# Altium schematic sheet 0073_HSIO MUXING -4.SchDoc
size 848 x 558 mm
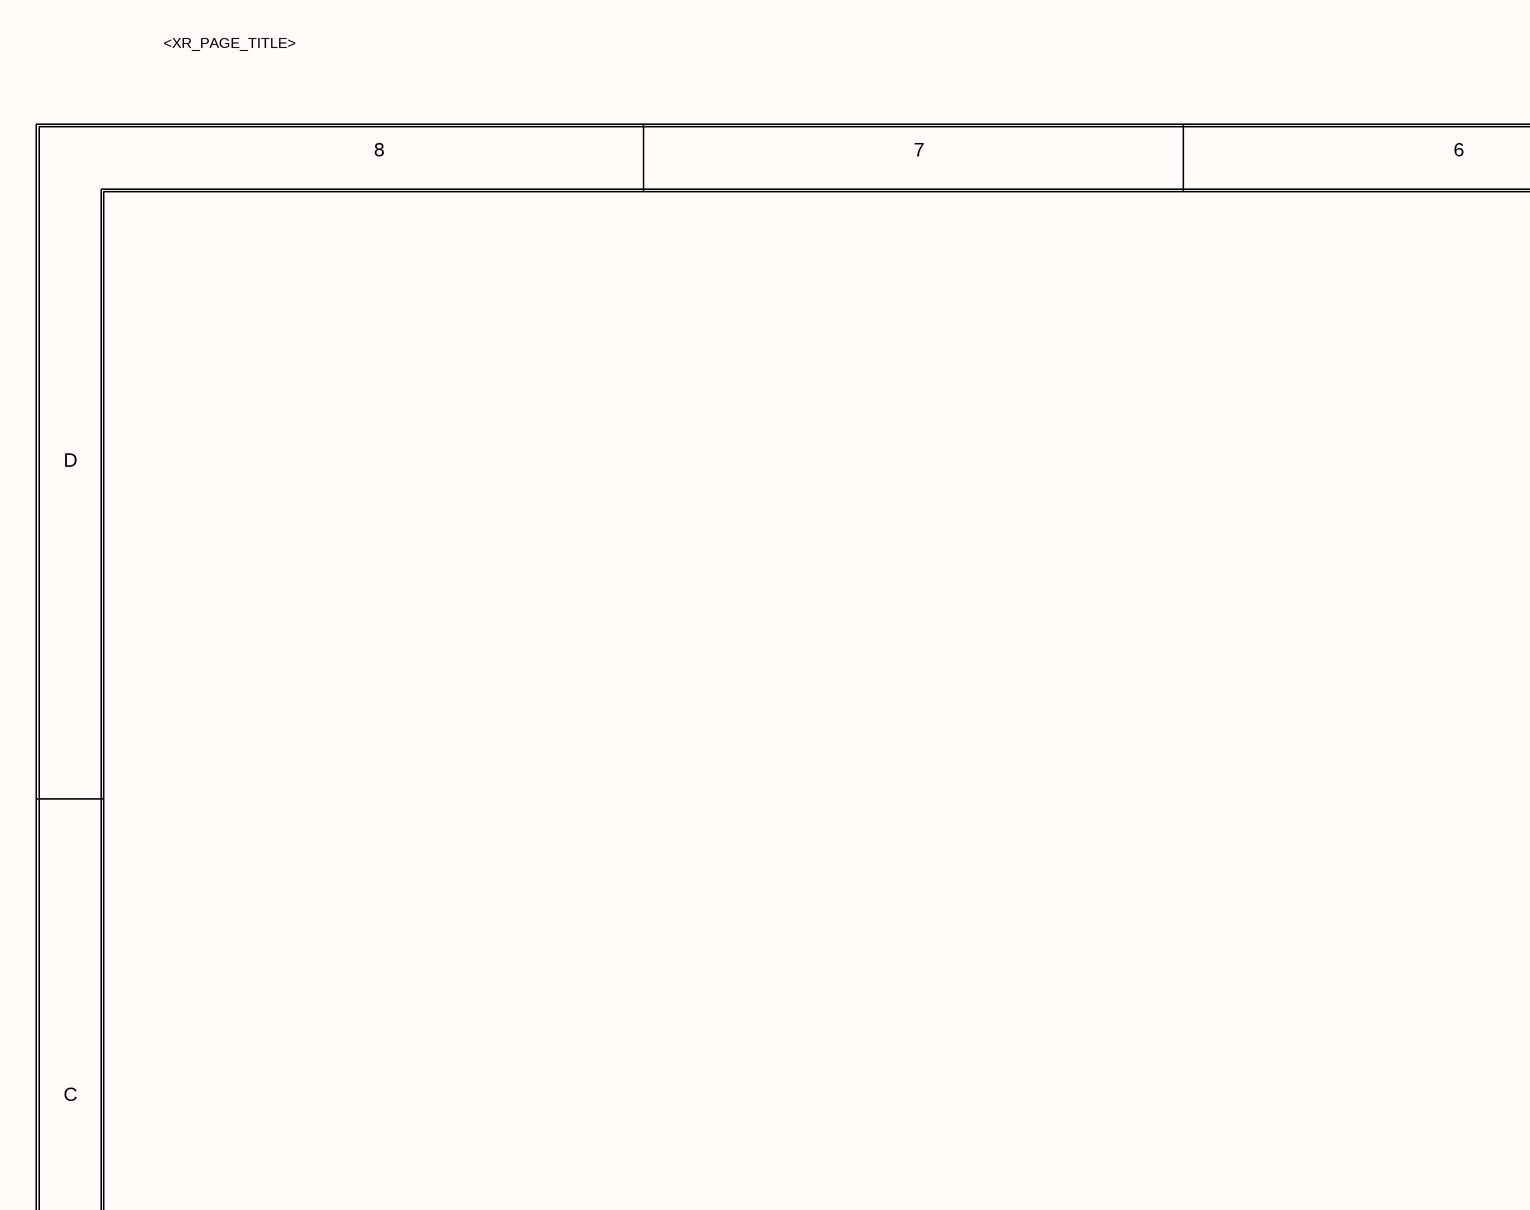
[diagram p0: 0073_HSIO MUXING -4.SchDoc, top left]
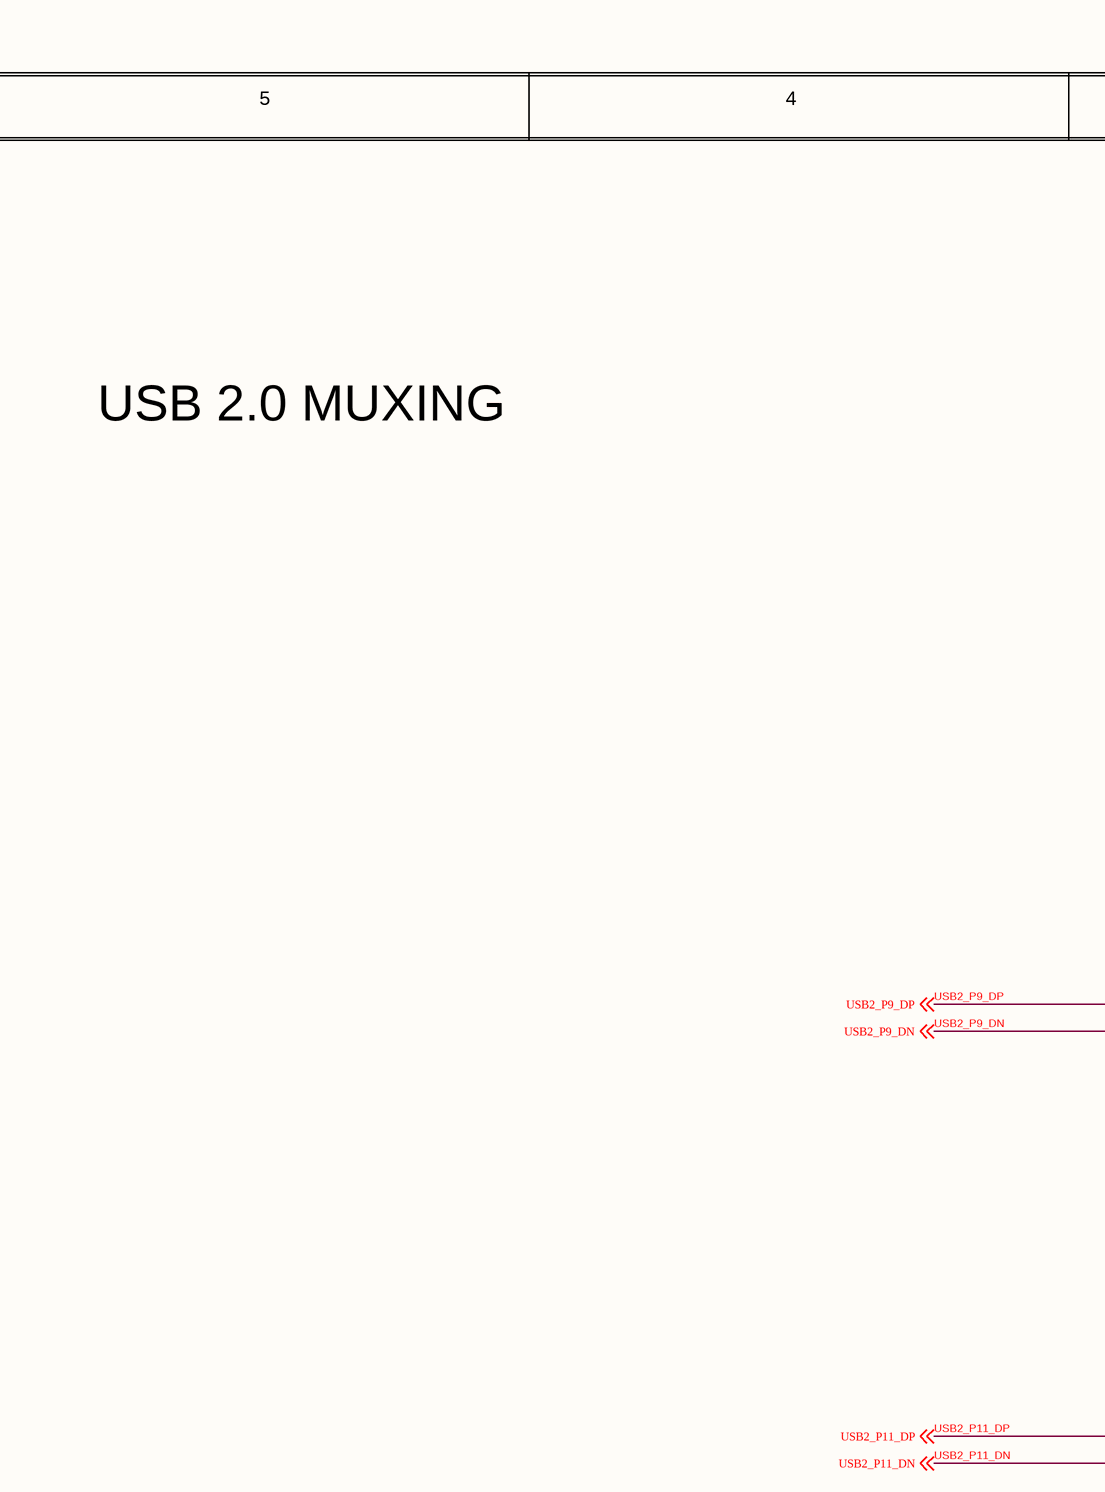
[diagram p1: 0073_HSIO MUXING -4.SchDoc, top middle]
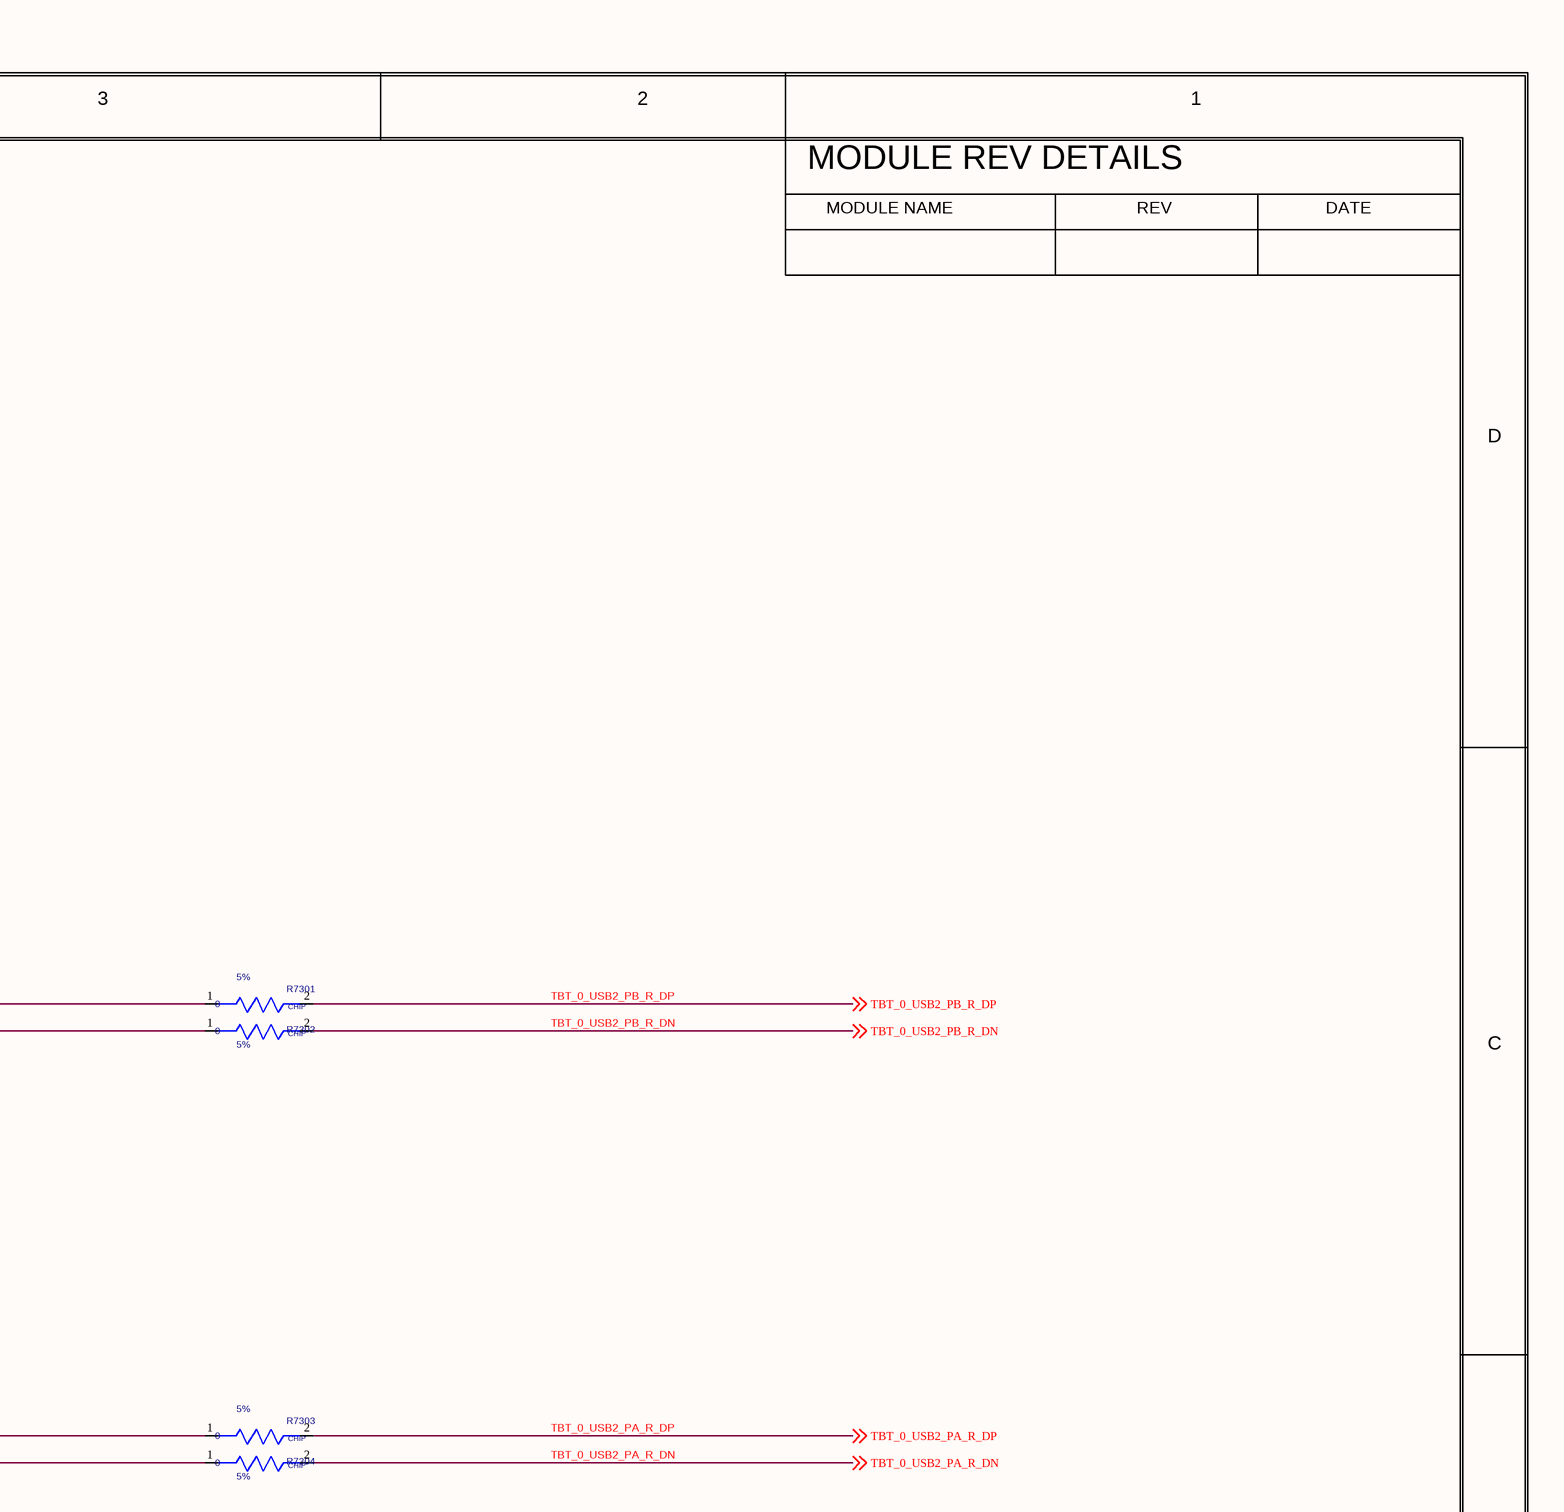
[diagram p2: 0073_HSIO MUXING -4.SchDoc, top right]
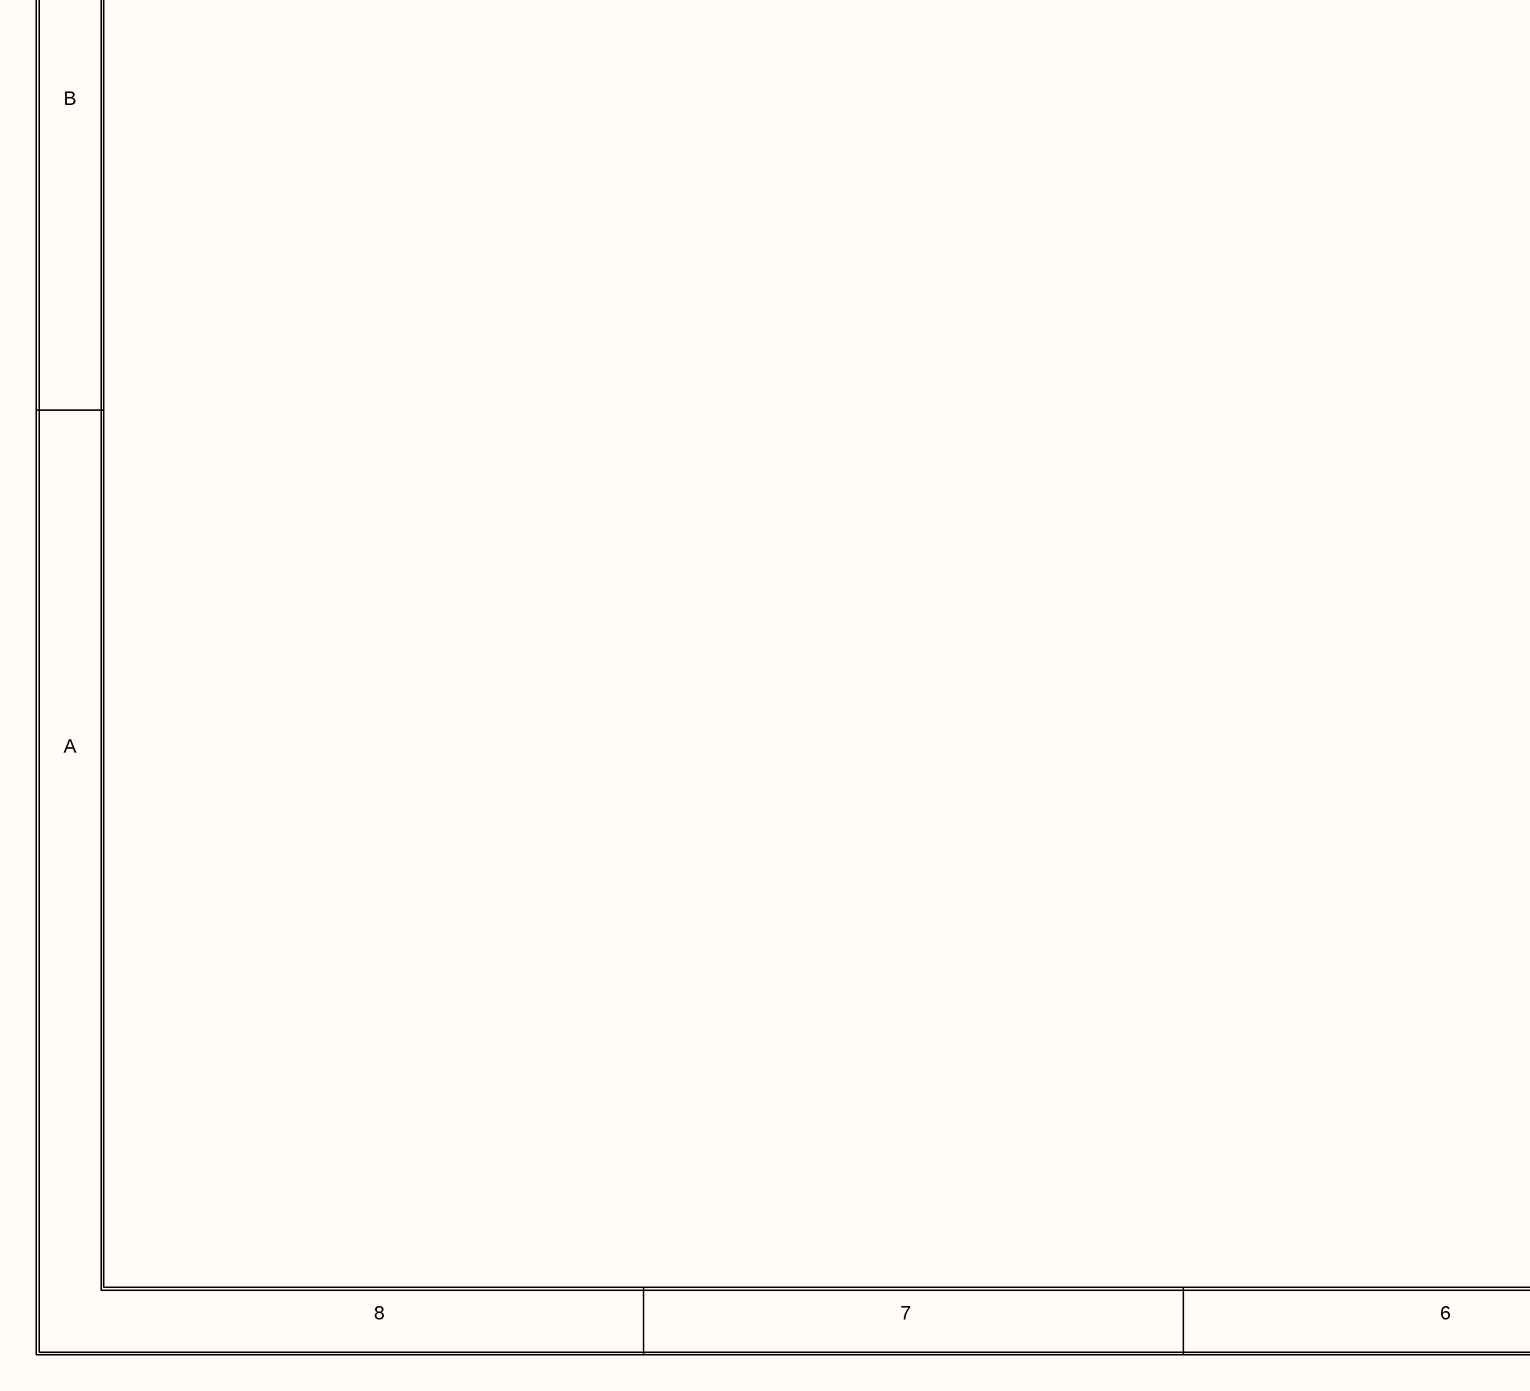
[diagram p3: 0073_HSIO MUXING -4.SchDoc, bottom left]
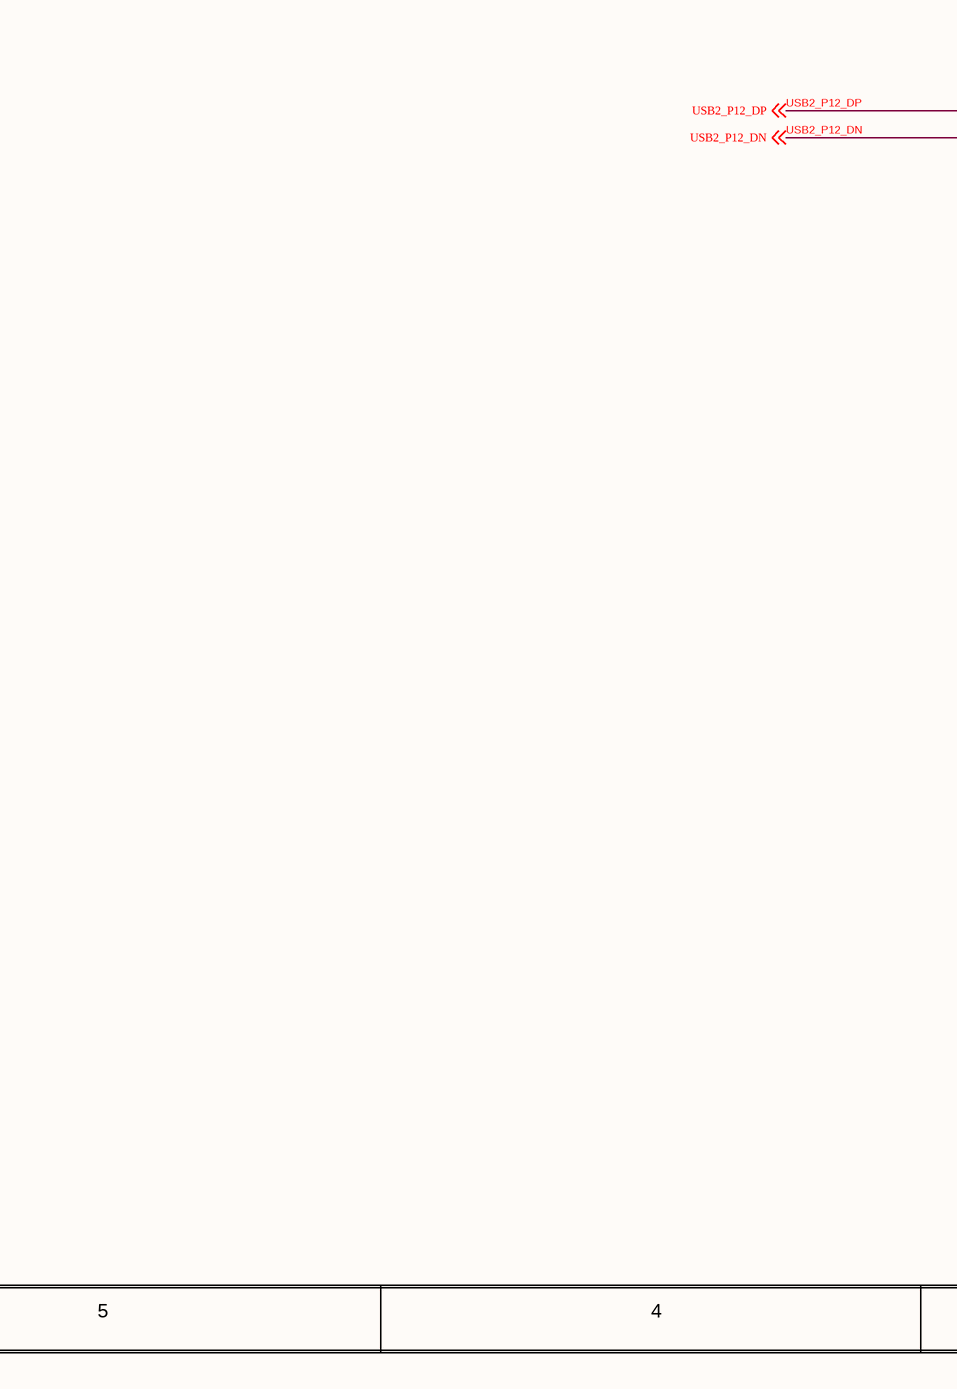
[diagram p4: 0073_HSIO MUXING -4.SchDoc, bottom middle]
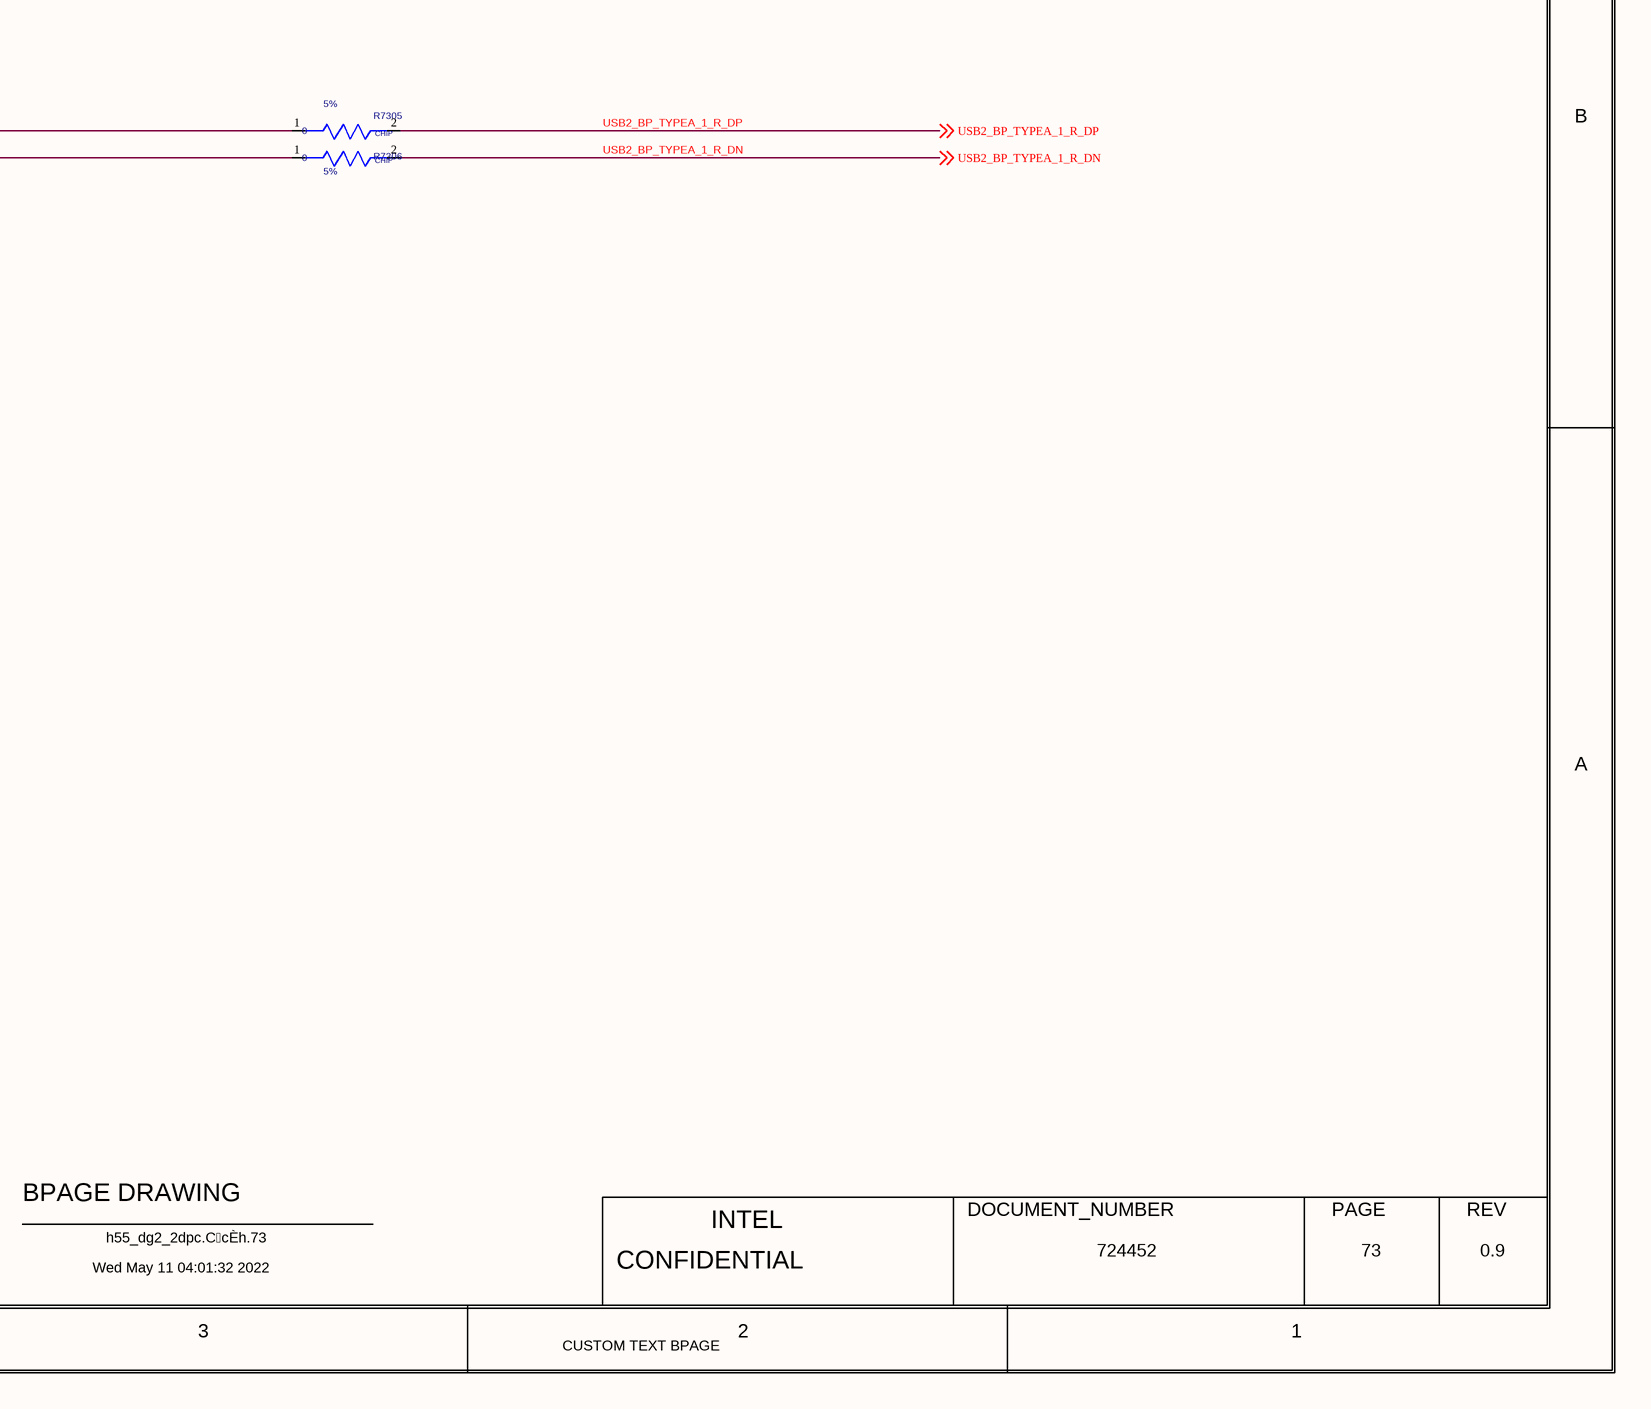
[diagram p5: 0073_HSIO MUXING -4.SchDoc, bottom right]

## Parts
R7301  0  MATERIAL: CHIP  TOLERANCE: 5%  [SMR0402IA]
R7302  0  MATERIAL: CHIP  TOLERANCE: 5%  [SMR0402IA]
R7303  0  MATERIAL: CHIP  TOLERANCE: 5%  [SMR0402IA]
R7304  0  MATERIAL: CHIP  TOLERANCE: 5%  [SMR0402IA]
R7305  0  MATERIAL: CHIP  TOLERANCE: 5%  [SMR0402IA]
R7306  0  MATERIAL: CHIP  TOLERANCE: 5%  [SMR0402IA]

## Nets
TBT_0_USB2_PA_R_DN: R7304.2(B) ; off-sheet TBT_0_USB2_PA_R_DN
TBT_0_USB2_PA_R_DP: R7303.2(B) ; off-sheet TBT_0_USB2_PA_R_DP
TBT_0_USB2_PB_R_DN: R7302.2(B) ; off-sheet TBT_0_USB2_PB_R_DN
TBT_0_USB2_PB_R_DP: R7301.2(B) ; off-sheet TBT_0_USB2_PB_R_DP
USB2_BP_TYPEA_1_R_DN: R7306.2(B) ; off-sheet USB2_BP_TYPEA_1_R_DN
USB2_BP_TYPEA_1_R_DP: R7305.2(B) ; off-sheet USB2_BP_TYPEA_1_R_DP
USB2_P9_DN: R7302.1(A) ; off-sheet USB2_P9_DN
USB2_P9_DP: R7301.1(A) ; off-sheet USB2_P9_DP
USB2_P11_DN: R7304.1(A) ; off-sheet USB2_P11_DN
USB2_P11_DP: R7303.1(A) ; off-sheet USB2_P11_DP
USB2_P12_DN: R7306.1(A) ; off-sheet USB2_P12_DN
USB2_P12_DP: R7305.1(A) ; off-sheet USB2_P12_DP

## Notes on the sheet
- <XR_PAGE_TITLE>
- 8
- 7
- 6
- 5
- 4
- 3
- 2
- 1
- MODULE REV DETAILS
- MODULE NAME
- REV
- DATE
- D
- USB 2.0 MUXING
- C
- B
- A
- BPAGE DRAWING
- INTEL
- DOCUMENT_NUMBER
- PAGE
- Wed May 11 04:01:32 2022
- h55_dg2_2dpc.CcÈh.73
- CONFIDENTIAL
- 724452
- 73
- 0.9
- CUSTOM TEXT BPAGE

## Library data of the parts
R7301 = RES#1: PART_NUMBER: A93549-001; CHIPS_PART_NAME: RES; CDS_PHYS_PART_NAME: RES_0402-A93549-001,CHIP,0,5%,1/16W,LPDB,GENERIC; PACK_TYPE: 0402; WATTAGE: 1/16W; OriginalSymbolOrigin: (-75,25); XY: (-2225,3400); VER: 1; PHYS_PAGE: 73; LOCATION: R7301; DRAWING: @RVP1_ADL_SB_ADP_S_DDR5_SODIMM_2DPC_LIB.H55_DG2_2DPC(SCH_1):PAGE73; CDS_LIB: discrete; PCB Footprint: SMR0402IA; SEC_TYPE: 0402; ROT: 0; CDS_PART_NAME: RES_0402-A93549-001,CHIP,0,5%,1/16W,LPDB,GENERIC; CDS_LOCATION: R7301; ASI_MODEL: A93549-001
R7302 = RES#1: PART_NUMBER: A93549-001; CHIPS_PART_NAME: RES; CDS_PHYS_PART_NAME: RES_0402-A93549-001,CHIP,0,5%,1/16W,LPDB,GENERIC; PACK_TYPE: 0402; WATTAGE: 1/16W; OriginalSymbolOrigin: (-75,25); XY: (-2225,3350); VER: 1; PHYS_PAGE: 73; LOCATION: R7302; DRAWING: @RVP1_ADL_SB_ADP_S_DDR5_SODIMM_2DPC_LIB.H55_DG2_2DPC(SCH_1):PAGE73; CDS_LIB: discrete; PCB Footprint: SMR0402IA; SEC_TYPE: 0402; ROT: 0; CDS_PART_NAME: RES_0402-A93549-001,CHIP,0,5%,1/16W,LPDB,GENERIC; CDS_LOCATION: R7302; ASI_MODEL: A93549-001
R7303 = RES#1: PART_NUMBER: A93549-001; CHIPS_PART_NAME: RES; CDS_PHYS_PART_NAME: RES_0402-A93549-001,CHIP,0,5%,1/16W,LPDB,GENERIC; PACK_TYPE: 0402; WATTAGE: 1/16W; OriginalSymbolOrigin: (-75,25); XY: (-2225,2600); VER: 1; PHYS_PAGE: 73; LOCATION: R7303; DRAWING: @RVP1_ADL_SB_ADP_S_DDR5_SODIMM_2DPC_LIB.H55_DG2_2DPC(SCH_1):PAGE73; CDS_LIB: discrete; PCB Footprint: SMR0402IA; SEC_TYPE: 0402; ROT: 0; CDS_PART_NAME: RES_0402-A93549-001,CHIP,0,5%,1/16W,LPDB,GENERIC; CDS_LOCATION: R7303; ASI_MODEL: A93549-001
R7304 = RES#1: PART_NUMBER: A93549-001; CHIPS_PART_NAME: RES; CDS_PHYS_PART_NAME: RES_0402-A93549-001,CHIP,0,5%,1/16W,LPDB,GENERIC; PACK_TYPE: 0402; WATTAGE: 1/16W; OriginalSymbolOrigin: (-75,25); XY: (-2225,2550); VER: 1; PHYS_PAGE: 73; LOCATION: R7304; DRAWING: @RVP1_ADL_SB_ADP_S_DDR5_SODIMM_2DPC_LIB.H55_DG2_2DPC(SCH_1):PAGE73; CDS_LIB: discrete; PCB Footprint: SMR0402IA; SEC_TYPE: 0402; ROT: 0; CDS_PART_NAME: RES_0402-A93549-001,CHIP,0,5%,1/16W,LPDB,GENERIC; CDS_LOCATION: R7304; ASI_MODEL: A93549-001
R7305 = RES#1: PART_NUMBER: A93549-001; CHIPS_PART_NAME: RES; CDS_PHYS_PART_NAME: RES_0402-A93549-001,CHIP,0,5%,1/16W,LPDB,GENERIC; PACK_TYPE: 0402; WATTAGE: 1/16W; OriginalSymbolOrigin: (-75,25); XY: (-2225,2175); VER: 1; PHYS_PAGE: 73; LOCATION: R7305; DRAWING: @RVP1_ADL_SB_ADP_S_DDR5_SODIMM_2DPC_LIB.H55_DG2_2DPC(SCH_1):PAGE73; CDS_LIB: discrete; PCB Footprint: SMR0402IA; SEC_TYPE: 0402; ROT: 0; CDS_PART_NAME: RES_0402-A93549-001,CHIP,0,5%,1/16W,LPDB,GENERIC; CDS_LOCATION: R7305; ASI_MODEL: A93549-001
R7306 = RES#1: PART_NUMBER: A93549-001; CHIPS_PART_NAME: RES; CDS_PHYS_PART_NAME: RES_0402-A93549-001,CHIP,0,5%,1/16W,LPDB,GENERIC; PACK_TYPE: 0402; WATTAGE: 1/16W; OriginalSymbolOrigin: (-75,25); XY: (-2225,2125); VER: 1; PHYS_PAGE: 73; LOCATION: R7306; DRAWING: @RVP1_ADL_SB_ADP_S_DDR5_SODIMM_2DPC_LIB.H55_DG2_2DPC(SCH_1):PAGE73; CDS_LIB: discrete; PCB Footprint: SMR0402IA; SEC_TYPE: 0402; ROT: 0; CDS_PART_NAME: RES_0402-A93549-001,CHIP,0,5%,1/16W,LPDB,GENERIC; CDS_LOCATION: R7306; ASI_MODEL: A93549-001